# EAGLE schematic 40x24 (EAGLE 6.2), part 1 of 2

## Sheet 1 of 4
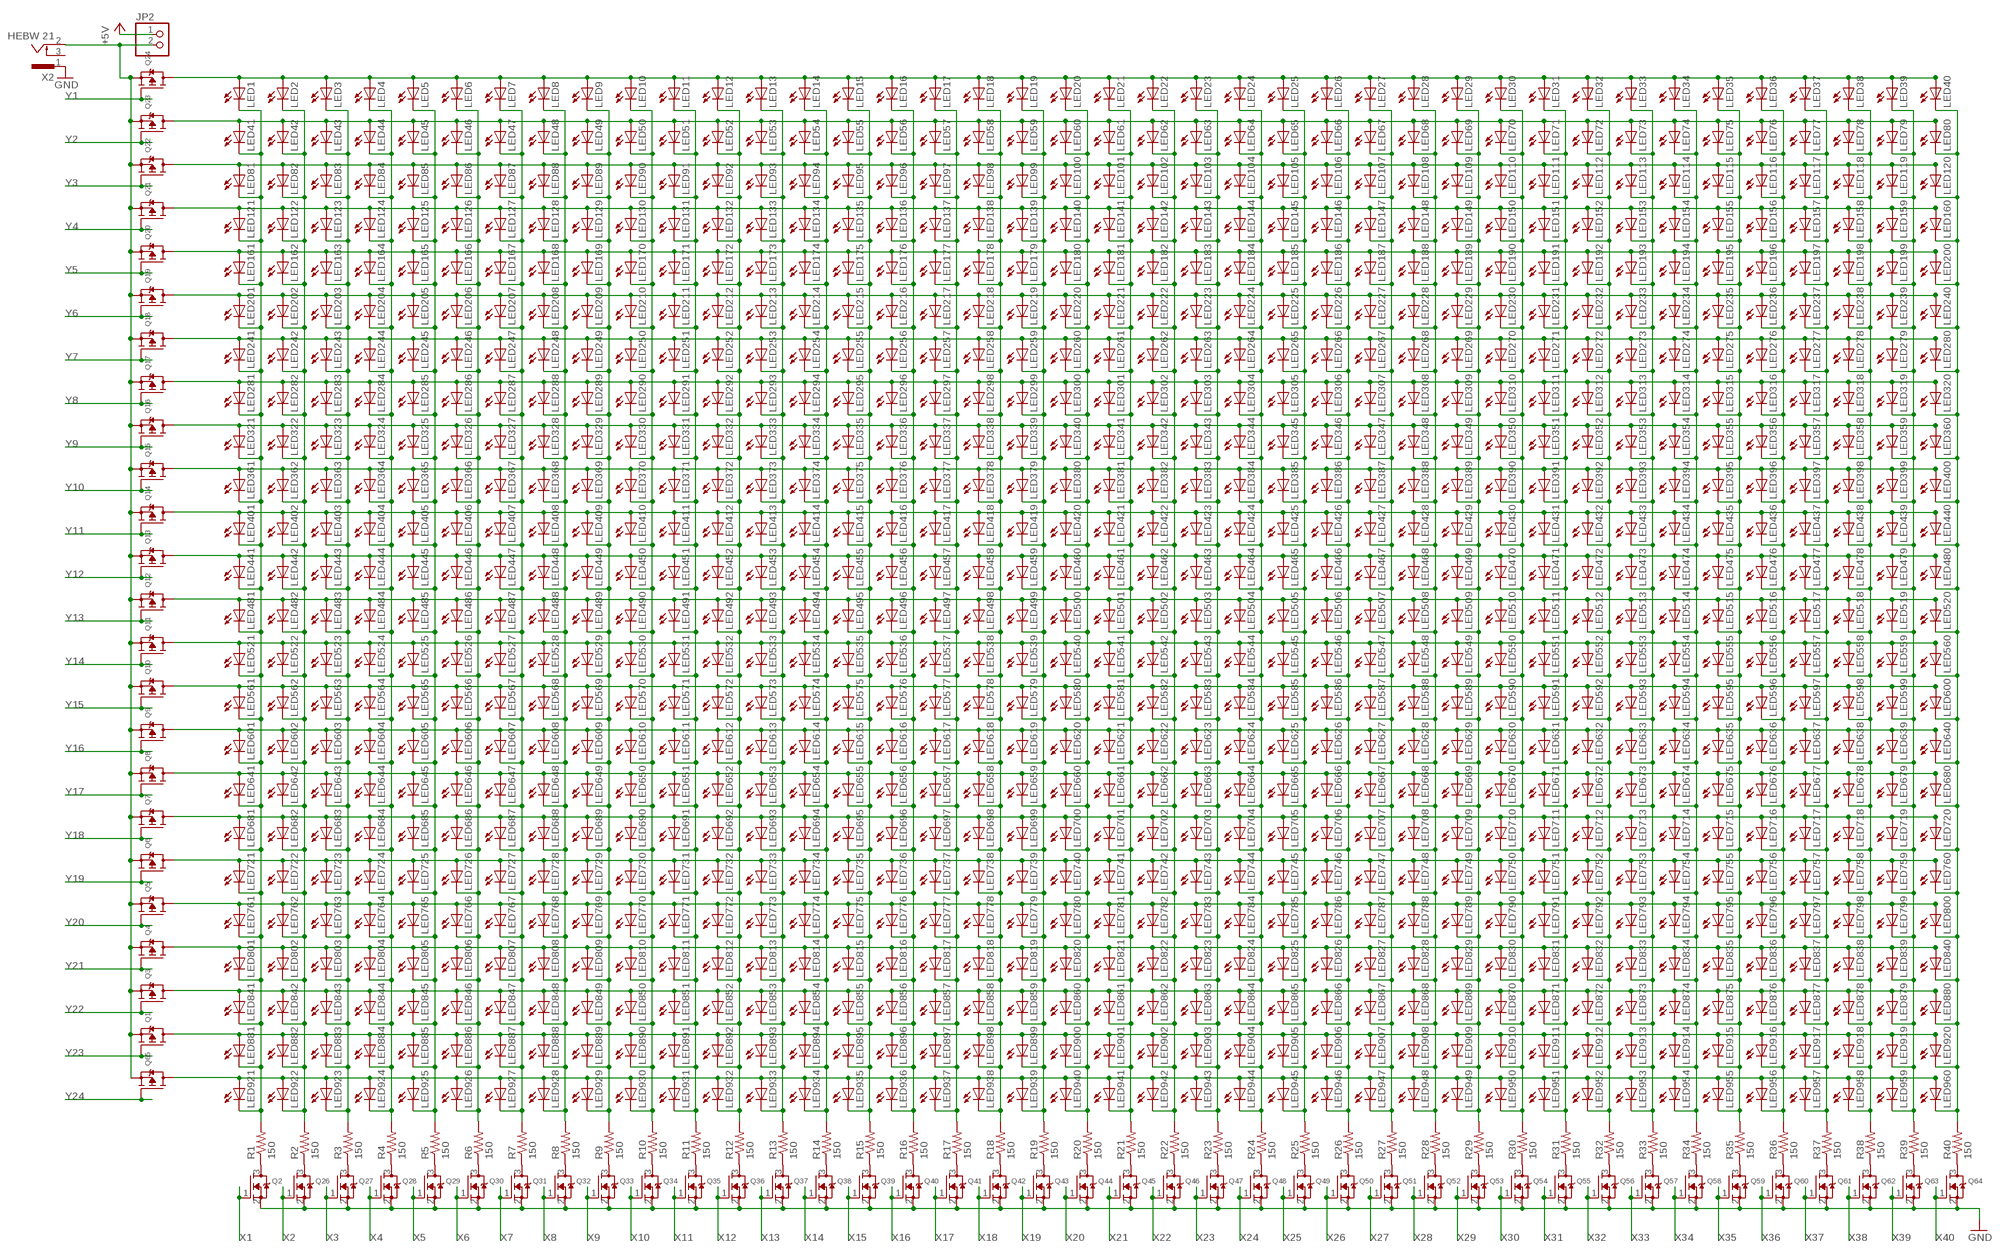
[diagram p0: schematic, sheet 1]

### Parts
JP2  PINHD-1X2  [1X02]
LED1  LED3MM  [LED3MM]
LED2  LED3MM  [LED3MM]
LED3  LED3MM  [LED3MM]
LED4  LED3MM  [LED3MM]
LED5  LED3MM  [LED3MM]
LED6  LED3MM  [LED3MM]
LED7  LED3MM  [LED3MM]
LED8  LED3MM  [LED3MM]
LED9  LED3MM  [LED3MM]
LED10  LED3MM  [LED3MM]
LED11  LED3MM  [LED3MM]
LED12  LED3MM  [LED3MM]
LED13  LED3MM  [LED3MM]
LED14  LED3MM  [LED3MM]
LED15  LED3MM  [LED3MM]
LED16  LED3MM  [LED3MM]
LED17  LED3MM  [LED3MM]
LED18  LED3MM  [LED3MM]
LED19  LED3MM  [LED3MM]
LED20  LED3MM  [LED3MM]
LED21  LED3MM  [LED3MM]
LED22  LED3MM  [LED3MM]
LED23  LED3MM  [LED3MM]
LED24  LED3MM  [LED3MM]
LED25  LED3MM  [LED3MM]
LED26  LED3MM  [LED3MM]
LED27  LED3MM  [LED3MM]
LED28  LED3MM  [LED3MM]
LED29  LED3MM  [LED3MM]
LED30  LED3MM  [LED3MM]
LED31  LED3MM  [LED3MM]
LED32  LED3MM  [LED3MM]
LED33  LED3MM  [LED3MM]
LED34  LED3MM  [LED3MM]
LED35  LED3MM  [LED3MM]
LED36  LED3MM  [LED3MM]
LED37  LED3MM  [LED3MM]
LED38  LED3MM  [LED3MM]
LED39  LED3MM  [LED3MM]
LED40  LED3MM  [LED3MM]
LED41  LED3MM  [LED3MM]
LED42  LED3MM  [LED3MM]
LED43  LED3MM  [LED3MM]
LED44  LED3MM  [LED3MM]
LED45  LED3MM  [LED3MM]
LED46  LED3MM  [LED3MM]
LED47  LED3MM  [LED3MM]
LED48  LED3MM  [LED3MM]
LED49  LED3MM  [LED3MM]
LED50  LED3MM  [LED3MM]
LED51  LED3MM  [LED3MM]
LED52  LED3MM  [LED3MM]
LED53  LED3MM  [LED3MM]
LED54  LED3MM  [LED3MM]
LED55  LED3MM  [LED3MM]
LED56  LED3MM  [LED3MM]
LED57  LED3MM  [LED3MM]
LED58  LED3MM  [LED3MM]
LED59  LED3MM  [LED3MM]
LED60  LED3MM  [LED3MM]
LED61  LED3MM  [LED3MM]
LED62  LED3MM  [LED3MM]
LED63  LED3MM  [LED3MM]
LED64  LED3MM  [LED3MM]
LED65  LED3MM  [LED3MM]
LED66  LED3MM  [LED3MM]
LED67  LED3MM  [LED3MM]
LED68  LED3MM  [LED3MM]
LED69  LED3MM  [LED3MM]
LED70  LED3MM  [LED3MM]
LED71  LED3MM  [LED3MM]
LED72  LED3MM  [LED3MM]
LED73  LED3MM  [LED3MM]
LED74  LED3MM  [LED3MM]
LED75  LED3MM  [LED3MM]
LED76  LED3MM  [LED3MM]
LED77  LED3MM  [LED3MM]
LED78  LED3MM  [LED3MM]
LED79  LED3MM  [LED3MM]
LED80  LED3MM  [LED3MM]
LED81  LED3MM  [LED3MM]
LED82  LED3MM  [LED3MM]
LED83  LED3MM  [LED3MM]
LED84  LED3MM  [LED3MM]
LED85  LED3MM  [LED3MM]
LED86  LED3MM  [LED3MM]
LED87  LED3MM  [LED3MM]
LED88  LED3MM  [LED3MM]
LED89  LED3MM  [LED3MM]
LED90  LED3MM  [LED3MM]
LED91  LED3MM  [LED3MM]
LED92  LED3MM  [LED3MM]
LED93  LED3MM  [LED3MM]
LED94  LED3MM  [LED3MM]
LED95  LED3MM  [LED3MM]
LED96  LED3MM  [LED3MM]
LED97  LED3MM  [LED3MM]
LED98  LED3MM  [LED3MM]
LED99  LED3MM  [LED3MM]
LED100  LED3MM  [LED3MM]
LED101  LED3MM  [LED3MM]
LED102  LED3MM  [LED3MM]
LED103  LED3MM  [LED3MM]
LED104  LED3MM  [LED3MM]
LED105  LED3MM  [LED3MM]
LED106  LED3MM  [LED3MM]
LED107  LED3MM  [LED3MM]
LED108  LED3MM  [LED3MM]
LED109  LED3MM  [LED3MM]
LED110  LED3MM  [LED3MM]
LED111  LED3MM  [LED3MM]
LED112  LED3MM  [LED3MM]
LED113  LED3MM  [LED3MM]
LED114  LED3MM  [LED3MM]
LED115  LED3MM  [LED3MM]
LED116  LED3MM  [LED3MM]
LED117  LED3MM  [LED3MM]
LED118  LED3MM  [LED3MM]
LED119  LED3MM  [LED3MM]
LED120  LED3MM  [LED3MM]
LED121  LED3MM  [LED3MM]
LED122  LED3MM  [LED3MM]
LED123  LED3MM  [LED3MM]
LED124  LED3MM  [LED3MM]
LED125  LED3MM  [LED3MM]
LED126  LED3MM  [LED3MM]
LED127  LED3MM  [LED3MM]
LED128  LED3MM  [LED3MM]
LED129  LED3MM  [LED3MM]
LED130  LED3MM  [LED3MM]
LED131  LED3MM  [LED3MM]
LED132  LED3MM  [LED3MM]
LED133  LED3MM  [LED3MM]
LED134  LED3MM  [LED3MM]
LED135  LED3MM  [LED3MM]
LED136  LED3MM  [LED3MM]
LED137  LED3MM  [LED3MM]
LED138  LED3MM  [LED3MM]
LED139  LED3MM  [LED3MM]
LED140  LED3MM  [LED3MM]
LED141  LED3MM  [LED3MM]
LED142  LED3MM  [LED3MM]
LED143  LED3MM  [LED3MM]
LED144  LED3MM  [LED3MM]
LED145  LED3MM  [LED3MM]
LED146  LED3MM  [LED3MM]
LED147  LED3MM  [LED3MM]
LED148  LED3MM  [LED3MM]
LED149  LED3MM  [LED3MM]
LED150  LED3MM  [LED3MM]
LED151  LED3MM  [LED3MM]
LED152  LED3MM  [LED3MM]
LED153  LED3MM  [LED3MM]
LED154  LED3MM  [LED3MM]
LED155  LED3MM  [LED3MM]
LED156  LED3MM  [LED3MM]
LED157  LED3MM  [LED3MM]
LED158  LED3MM  [LED3MM]
LED159  LED3MM  [LED3MM]
LED160  LED3MM  [LED3MM]
LED161  LED3MM  [LED3MM]
LED162  LED3MM  [LED3MM]
LED163  LED3MM  [LED3MM]
LED164  LED3MM  [LED3MM]
LED165  LED3MM  [LED3MM]
LED166  LED3MM  [LED3MM]
LED167  LED3MM  [LED3MM]
LED168  LED3MM  [LED3MM]
LED169  LED3MM  [LED3MM]
LED170  LED3MM  [LED3MM]
LED171  LED3MM  [LED3MM]
LED172  LED3MM  [LED3MM]
LED173  LED3MM  [LED3MM]
LED174  LED3MM  [LED3MM]
LED175  LED3MM  [LED3MM]
LED176  LED3MM  [LED3MM]
LED177  LED3MM  [LED3MM]
LED178  LED3MM  [LED3MM]
LED179  LED3MM  [LED3MM]
LED180  LED3MM  [LED3MM]
LED181  LED3MM  [LED3MM]
LED182  LED3MM  [LED3MM]
LED183  LED3MM  [LED3MM]
LED184  LED3MM  [LED3MM]
LED185  LED3MM  [LED3MM]
LED186  LED3MM  [LED3MM]
LED187  LED3MM  [LED3MM]
LED188  LED3MM  [LED3MM]
LED189  LED3MM  [LED3MM]
LED190  LED3MM  [LED3MM]
LED191  LED3MM  [LED3MM]
LED192  LED3MM  [LED3MM]
LED193  LED3MM  [LED3MM]
LED194  LED3MM  [LED3MM]
LED195  LED3MM  [LED3MM]
LED196  LED3MM  [LED3MM]
LED197  LED3MM  [LED3MM]
LED198  LED3MM  [LED3MM]
LED199  LED3MM  [LED3MM]
LED200  LED3MM  [LED3MM]
LED201  LED3MM  [LED3MM]
LED202  LED3MM  [LED3MM]
LED203  LED3MM  [LED3MM]
LED204  LED3MM  [LED3MM]
LED205  LED3MM  [LED3MM]
LED206  LED3MM  [LED3MM]
LED207  LED3MM  [LED3MM]
LED208  LED3MM  [LED3MM]
LED209  LED3MM  [LED3MM]
LED210  LED3MM  [LED3MM]
LED211  LED3MM  [LED3MM]
LED212  LED3MM  [LED3MM]
LED213  LED3MM  [LED3MM]
LED214  LED3MM  [LED3MM]
LED215  LED3MM  [LED3MM]
LED216  LED3MM  [LED3MM]
LED217  LED3MM  [LED3MM]
LED218  LED3MM  [LED3MM]
LED219  LED3MM  [LED3MM]
LED220  LED3MM  [LED3MM]
LED221  LED3MM  [LED3MM]
LED222  LED3MM  [LED3MM]
LED223  LED3MM  [LED3MM]
LED224  LED3MM  [LED3MM]
LED225  LED3MM  [LED3MM]
LED226  LED3MM  [LED3MM]
LED227  LED3MM  [LED3MM]
LED228  LED3MM  [LED3MM]
LED229  LED3MM  [LED3MM]
LED230  LED3MM  [LED3MM]
LED231  LED3MM  [LED3MM]
LED232  LED3MM  [LED3MM]
LED233  LED3MM  [LED3MM]
LED234  LED3MM  [LED3MM]
LED235  LED3MM  [LED3MM]
LED236  LED3MM  [LED3MM]
LED237  LED3MM  [LED3MM]
LED238  LED3MM  [LED3MM]
LED239  LED3MM  [LED3MM]
LED240  LED3MM  [LED3MM]
LED241  LED3MM  [LED3MM]
LED242  LED3MM  [LED3MM]
LED243  LED3MM  [LED3MM]
LED244  LED3MM  [LED3MM]
LED245  LED3MM  [LED3MM]
LED246  LED3MM  [LED3MM]
LED247  LED3MM  [LED3MM]
LED248  LED3MM  [LED3MM]
LED249  LED3MM  [LED3MM]
LED250  LED3MM  [LED3MM]
LED251  LED3MM  [LED3MM]
LED252  LED3MM  [LED3MM]
LED253  LED3MM  [LED3MM]
LED254  LED3MM  [LED3MM]
LED255  LED3MM  [LED3MM]
LED256  LED3MM  [LED3MM]
LED257  LED3MM  [LED3MM]
LED258  LED3MM  [LED3MM]
LED259  LED3MM  [LED3MM]
LED260  LED3MM  [LED3MM]
LED261  LED3MM  [LED3MM]
LED262  LED3MM  [LED3MM]
LED263  LED3MM  [LED3MM]
LED264  LED3MM  [LED3MM]
LED265  LED3MM  [LED3MM]
LED266  LED3MM  [LED3MM]
LED267  LED3MM  [LED3MM]
LED268  LED3MM  [LED3MM]
LED269  LED3MM  [LED3MM]
LED270  LED3MM  [LED3MM]
LED271  LED3MM  [LED3MM]
LED272  LED3MM  [LED3MM]
LED273  LED3MM  [LED3MM]
LED274  LED3MM  [LED3MM]
LED275  LED3MM  [LED3MM]
LED276  LED3MM  [LED3MM]
LED277  LED3MM  [LED3MM]
LED278  LED3MM  [LED3MM]
LED279  LED3MM  [LED3MM]
LED280  LED3MM  [LED3MM]
LED281  LED3MM  [LED3MM]
LED282  LED3MM  [LED3MM]
LED283  LED3MM  [LED3MM]
LED284  LED3MM  [LED3MM]
LED285  LED3MM  [LED3MM]
LED286  LED3MM  [LED3MM]
LED287  LED3MM  [LED3MM]
LED288  LED3MM  [LED3MM]
LED289  LED3MM  [LED3MM]
LED290  LED3MM  [LED3MM]
LED291  LED3MM  [LED3MM]
LED292  LED3MM  [LED3MM]
LED293  LED3MM  [LED3MM]
LED294  LED3MM  [LED3MM]
LED295  LED3MM  [LED3MM]
LED296  LED3MM  [LED3MM]
LED297  LED3MM  [LED3MM]
LED298  LED3MM  [LED3MM]
LED299  LED3MM  [LED3MM]
LED300  LED3MM  [LED3MM]
LED301  LED3MM  [LED3MM]
LED302  LED3MM  [LED3MM]
LED303  LED3MM  [LED3MM]
LED304  LED3MM  [LED3MM]
LED305  LED3MM  [LED3MM]
LED306  LED3MM  [LED3MM]
LED307  LED3MM  [LED3MM]
LED308  LED3MM  [LED3MM]
LED309  LED3MM  [LED3MM]
LED310  LED3MM  [LED3MM]
LED311  LED3MM  [LED3MM]
LED312  LED3MM  [LED3MM]
LED313  LED3MM  [LED3MM]
LED314  LED3MM  [LED3MM]
LED315  LED3MM  [LED3MM]
LED316  LED3MM  [LED3MM]
LED317  LED3MM  [LED3MM]
LED318  LED3MM  [LED3MM]
LED319  LED3MM  [LED3MM]
LED320  LED3MM  [LED3MM]
LED321  LED3MM  [LED3MM]
LED322  LED3MM  [LED3MM]
LED323  LED3MM  [LED3MM]
LED324  LED3MM  [LED3MM]
LED325  LED3MM  [LED3MM]
LED326  LED3MM  [LED3MM]
LED327  LED3MM  [LED3MM]
LED328  LED3MM  [LED3MM]
LED329  LED3MM  [LED3MM]
LED330  LED3MM  [LED3MM]
LED331  LED3MM  [LED3MM]
LED332  LED3MM  [LED3MM]
LED333  LED3MM  [LED3MM]
LED334  LED3MM  [LED3MM]
LED335  LED3MM  [LED3MM]
LED336  LED3MM  [LED3MM]
LED337  LED3MM  [LED3MM]
LED338  LED3MM  [LED3MM]
LED339  LED3MM  [LED3MM]
LED340  LED3MM  [LED3MM]
LED341  LED3MM  [LED3MM]
LED342  LED3MM  [LED3MM]
LED343  LED3MM  [LED3MM]
LED344  LED3MM  [LED3MM]
LED345  LED3MM  [LED3MM]
LED346  LED3MM  [LED3MM]
LED347  LED3MM  [LED3MM]
LED348  LED3MM  [LED3MM]
LED349  LED3MM  [LED3MM]
LED350  LED3MM  [LED3MM]
LED351  LED3MM  [LED3MM]
LED352  LED3MM  [LED3MM]
LED353  LED3MM  [LED3MM]
LED354  LED3MM  [LED3MM]
LED355  LED3MM  [LED3MM]
LED356  LED3MM  [LED3MM]
LED357  LED3MM  [LED3MM]
LED358  LED3MM  [LED3MM]
LED359  LED3MM  [LED3MM]
LED360  LED3MM  [LED3MM]
LED361  LED3MM  [LED3MM]
LED362  LED3MM  [LED3MM]
LED363  LED3MM  [LED3MM]
LED364  LED3MM  [LED3MM]
LED365  LED3MM  [LED3MM]
LED366  LED3MM  [LED3MM]
LED367  LED3MM  [LED3MM]
LED368  LED3MM  [LED3MM]
LED369  LED3MM  [LED3MM]
LED370  LED3MM  [LED3MM]
LED371  LED3MM  [LED3MM]
LED372  LED3MM  [LED3MM]
LED373  LED3MM  [LED3MM]
LED374  LED3MM  [LED3MM]
LED375  LED3MM  [LED3MM]
LED376  LED3MM  [LED3MM]
LED377  LED3MM  [LED3MM]
LED378  LED3MM  [LED3MM]
LED379  LED3MM  [LED3MM]
LED380  LED3MM  [LED3MM]
LED381  LED3MM  [LED3MM]
LED382  LED3MM  [LED3MM]
LED383  LED3MM  [LED3MM]
LED384  LED3MM  [LED3MM]
LED385  LED3MM  [LED3MM]
LED386  LED3MM  [LED3MM]
LED387  LED3MM  [LED3MM]
LED388  LED3MM  [LED3MM]
LED389  LED3MM  [LED3MM]
LED390  LED3MM  [LED3MM]
LED391  LED3MM  [LED3MM]
LED392  LED3MM  [LED3MM]
LED393  LED3MM  [LED3MM]
LED394  LED3MM  [LED3MM]
LED395  LED3MM  [LED3MM]
LED396  LED3MM  [LED3MM]
LED397  LED3MM  [LED3MM]
LED398  LED3MM  [LED3MM]
LED399  LED3MM  [LED3MM]
LED400  LED3MM  [LED3MM]
LED401  LED3MM  [LED3MM]
LED402  LED3MM  [LED3MM]
LED403  LED3MM  [LED3MM]
LED404  LED3MM  [LED3MM]
LED405  LED3MM  [LED3MM]
LED406  LED3MM  [LED3MM]
LED407  LED3MM  [LED3MM]
LED408  LED3MM  [LED3MM]
LED409  LED3MM  [LED3MM]
LED410  LED3MM  [LED3MM]
LED411  LED3MM  [LED3MM]
LED412  LED3MM  [LED3MM]
LED413  LED3MM  [LED3MM]
LED414  LED3MM  [LED3MM]
LED415  LED3MM  [LED3MM]
LED416  LED3MM  [LED3MM]
LED417  LED3MM  [LED3MM]
LED418  LED3MM  [LED3MM]
LED419  LED3MM  [LED3MM]
LED420  LED3MM  [LED3MM]
LED421  LED3MM  [LED3MM]
LED422  LED3MM  [LED3MM]
LED423  LED3MM  [LED3MM]
LED424  LED3MM  [LED3MM]
LED425  LED3MM  [LED3MM]
LED426  LED3MM  [LED3MM]
LED427  LED3MM  [LED3MM]
LED428  LED3MM  [LED3MM]
LED429  LED3MM  [LED3MM]
LED430  LED3MM  [LED3MM]
LED431  LED3MM  [LED3MM]
LED432  LED3MM  [LED3MM]
LED433  LED3MM  [LED3MM]
LED434  LED3MM  [LED3MM]
LED435  LED3MM  [LED3MM]
LED436  LED3MM  [LED3MM]
LED437  LED3MM  [LED3MM]
LED438  LED3MM  [LED3MM]
LED439  LED3MM  [LED3MM]
LED440  LED3MM  [LED3MM]
LED441  LED3MM  [LED3MM]
LED442  LED3MM  [LED3MM]
LED443  LED3MM  [LED3MM]
LED444  LED3MM  [LED3MM]
LED445  LED3MM  [LED3MM]
LED446  LED3MM  [LED3MM]
LED447  LED3MM  [LED3MM]
LED448  LED3MM  [LED3MM]
LED449  LED3MM  [LED3MM]
LED450  LED3MM  [LED3MM]
LED451  LED3MM  [LED3MM]
LED452  LED3MM  [LED3MM]
LED453  LED3MM  [LED3MM]
LED454  LED3MM  [LED3MM]
LED455  LED3MM  [LED3MM]
LED456  LED3MM  [LED3MM]
LED457  LED3MM  [LED3MM]
LED458  LED3MM  [LED3MM]
LED459  LED3MM  [LED3MM]
LED460  LED3MM  [LED3MM]
LED461  LED3MM  [LED3MM]
LED462  LED3MM  [LED3MM]
LED463  LED3MM  [LED3MM]
LED464  LED3MM  [LED3MM]
LED465  LED3MM  [LED3MM]
LED466  LED3MM  [LED3MM]
LED467  LED3MM  [LED3MM]
LED468  LED3MM  [LED3MM]
LED469  LED3MM  [LED3MM]
LED470  LED3MM  [LED3MM]
LED471  LED3MM  [LED3MM]
LED472  LED3MM  [LED3MM]
LED473  LED3MM  [LED3MM]
LED474  LED3MM  [LED3MM]
LED475  LED3MM  [LED3MM]
LED476  LED3MM  [LED3MM]
LED477  LED3MM  [LED3MM]
LED478  LED3MM  [LED3MM]
LED479  LED3MM  [LED3MM]
LED480  LED3MM  [LED3MM]
LED481  LED3MM  [LED3MM]
LED482  LED3MM  [LED3MM]
LED483  LED3MM  [LED3MM]
LED484  LED3MM  [LED3MM]
LED485  LED3MM  [LED3MM]
LED486  LED3MM  [LED3MM]
LED487  LED3MM  [LED3MM]
LED488  LED3MM  [LED3MM]
LED489  LED3MM  [LED3MM]
LED490  LED3MM  [LED3MM]
LED491  LED3MM  [LED3MM]
LED492  LED3MM  [LED3MM]
LED493  LED3MM  [LED3MM]
LED494  LED3MM  [LED3MM]
LED495  LED3MM  [LED3MM]
LED496  LED3MM  [LED3MM]
LED497  LED3MM  [LED3MM]
LED498  LED3MM  [LED3MM]
LED499  LED3MM  [LED3MM]
LED500  LED3MM  [LED3MM]
LED501  LED3MM  [LED3MM]
LED502  LED3MM  [LED3MM]
LED503  LED3MM  [LED3MM]
LED504  LED3MM  [LED3MM]
LED505  LED3MM  [LED3MM]
LED506  LED3MM  [LED3MM]
LED507  LED3MM  [LED3MM]
LED508  LED3MM  [LED3MM]
LED509  LED3MM  [LED3MM]
LED510  LED3MM  [LED3MM]
LED511  LED3MM  [LED3MM]
LED512  LED3MM  [LED3MM]
LED513  LED3MM  [LED3MM]
LED514  LED3MM  [LED3MM]
LED515  LED3MM  [LED3MM]
LED516  LED3MM  [LED3MM]
LED517  LED3MM  [LED3MM]
LED518  LED3MM  [LED3MM]
LED519  LED3MM  [LED3MM]
LED520  LED3MM  [LED3MM]
LED521  LED3MM  [LED3MM]
LED522  LED3MM  [LED3MM]
LED523  LED3MM  [LED3MM]
LED524  LED3MM  [LED3MM]
LED525  LED3MM  [LED3MM]
LED526  LED3MM  [LED3MM]
LED527  LED3MM  [LED3MM]
LED528  LED3MM  [LED3MM]
LED529  LED3MM  [LED3MM]
LED530  LED3MM  [LED3MM]
LED531  LED3MM  [LED3MM]
LED532  LED3MM  [LED3MM]
LED533  LED3MM  [LED3MM]
LED534  LED3MM  [LED3MM]
LED535  LED3MM  [LED3MM]
LED536  LED3MM  [LED3MM]
LED537  LED3MM  [LED3MM]
LED538  LED3MM  [LED3MM]
LED539  LED3MM  [LED3MM]
LED540  LED3MM  [LED3MM]
LED541  LED3MM  [LED3MM]
LED542  LED3MM  [LED3MM]
LED543  LED3MM  [LED3MM]
LED544  LED3MM  [LED3MM]
LED545  LED3MM  [LED3MM]
LED546  LED3MM  [LED3MM]
LED547  LED3MM  [LED3MM]
LED548  LED3MM  [LED3MM]
LED549  LED3MM  [LED3MM]
LED550  LED3MM  [LED3MM]
LED551  LED3MM  [LED3MM]
LED552  LED3MM  [LED3MM]
LED553  LED3MM  [LED3MM]
LED554  LED3MM  [LED3MM]
LED555  LED3MM  [LED3MM]
LED556  LED3MM  [LED3MM]
LED557  LED3MM  [LED3MM]
LED558  LED3MM  [LED3MM]
LED559  LED3MM  [LED3MM]
LED560  LED3MM  [LED3MM]
LED561  LED3MM  [LED3MM]
LED562  LED3MM  [LED3MM]
LED563  LED3MM  [LED3MM]
LED564  LED3MM  [LED3MM]
LED565  LED3MM  [LED3MM]
LED566  LED3MM  [LED3MM]
LED567  LED3MM  [LED3MM]
LED568  LED3MM  [LED3MM]
LED569  LED3MM  [LED3MM]
LED570  LED3MM  [LED3MM]
LED571  LED3MM  [LED3MM]
LED572  LED3MM  [LED3MM]
LED573  LED3MM  [LED3MM]
LED574  LED3MM  [LED3MM]
LED575  LED3MM  [LED3MM]
LED576  LED3MM  [LED3MM]
LED577  LED3MM  [LED3MM]
LED578  LED3MM  [LED3MM]
LED579  LED3MM  [LED3MM]
LED580  LED3MM  [LED3MM]
LED581  LED3MM  [LED3MM]
LED582  LED3MM  [LED3MM]
LED583  LED3MM  [LED3MM]
LED584  LED3MM  [LED3MM]
LED585  LED3MM  [LED3MM]
LED586  LED3MM  [LED3MM]
LED587  LED3MM  [LED3MM]
LED588  LED3MM  [LED3MM]
LED589  LED3MM  [LED3MM]
LED590  LED3MM  [LED3MM]
LED591  LED3MM  [LED3MM]
LED592  LED3MM  [LED3MM]
LED593  LED3MM  [LED3MM]
LED594  LED3MM  [LED3MM]
LED595  LED3MM  [LED3MM]
LED596  LED3MM  [LED3MM]
LED597  LED3MM  [LED3MM]
LED598  LED3MM  [LED3MM]
LED599  LED3MM  [LED3MM]
LED600  LED3MM  [LED3MM]
LED601  LED3MM  [LED3MM]
LED602  LED3MM  [LED3MM]
LED603  LED3MM  [LED3MM]
LED604  LED3MM  [LED3MM]
LED605  LED3MM  [LED3MM]
LED606  LED3MM  [LED3MM]
LED607  LED3MM  [LED3MM]
LED608  LED3MM  [LED3MM]
LED609  LED3MM  [LED3MM]
LED610  LED3MM  [LED3MM]
LED611  LED3MM  [LED3MM]
LED612  LED3MM  [LED3MM]
LED613  LED3MM  [LED3MM]
LED614  LED3MM  [LED3MM]
LED615  LED3MM  [LED3MM]
LED616  LED3MM  [LED3MM]
LED617  LED3MM  [LED3MM]
LED618  LED3MM  [LED3MM]
LED619  LED3MM  [LED3MM]
LED620  LED3MM  [LED3MM]
LED621  LED3MM  [LED3MM]
LED622  LED3MM  [LED3MM]
LED623  LED3MM  [LED3MM]
LED624  LED3MM  [LED3MM]
LED625  LED3MM  [LED3MM]
LED626  LED3MM  [LED3MM]
LED627  LED3MM  [LED3MM]
LED628  LED3MM  [LED3MM]
LED629  LED3MM  [LED3MM]
LED630  LED3MM  [LED3MM]
LED631  LED3MM  [LED3MM]
LED632  LED3MM  [LED3MM]
LED633  LED3MM  [LED3MM]
LED634  LED3MM  [LED3MM]
LED635  LED3MM  [LED3MM]
LED636  LED3MM  [LED3MM]
LED637  LED3MM  [LED3MM]
LED638  LED3MM  [LED3MM]
LED639  LED3MM  [LED3MM]
LED640  LED3MM  [LED3MM]
LED641  LED3MM  [LED3MM]
LED642  LED3MM  [LED3MM]
LED643  LED3MM  [LED3MM]
LED644  LED3MM  [LED3MM]
LED645  LED3MM  [LED3MM]
LED646  LED3MM  [LED3MM]
LED647  LED3MM  [LED3MM]
LED648  LED3MM  [LED3MM]
LED649  LED3MM  [LED3MM]
LED650  LED3MM  [LED3MM]
LED651  LED3MM  [LED3MM]
LED652  LED3MM  [LED3MM]
LED653  LED3MM  [LED3MM]
LED654  LED3MM  [LED3MM]
LED655  LED3MM  [LED3MM]
LED656  LED3MM  [LED3MM]
LED657  LED3MM  [LED3MM]
LED658  LED3MM  [LED3MM]
LED659  LED3MM  [LED3MM]
LED660  LED3MM  [LED3MM]
LED661  LED3MM  [LED3MM]
LED662  LED3MM  [LED3MM]
LED663  LED3MM  [LED3MM]
LED664  LED3MM  [LED3MM]
LED665  LED3MM  [LED3MM]
LED666  LED3MM  [LED3MM]
LED667  LED3MM  [LED3MM]
LED668  LED3MM  [LED3MM]
LED669  LED3MM  [LED3MM]
LED670  LED3MM  [LED3MM]
LED671  LED3MM  [LED3MM]
LED672  LED3MM  [LED3MM]
LED673  LED3MM  [LED3MM]
LED674  LED3MM  [LED3MM]
LED675  LED3MM  [LED3MM]
LED676  LED3MM  [LED3MM]
LED677  LED3MM  [LED3MM]
LED678  LED3MM  [LED3MM]
LED679  LED3MM  [LED3MM]
LED680  LED3MM  [LED3MM]
LED681  LED3MM  [LED3MM]
LED682  LED3MM  [LED3MM]
LED683  LED3MM  [LED3MM]
LED684  LED3MM  [LED3MM]
LED685  LED3MM  [LED3MM]
LED686  LED3MM  [LED3MM]
LED687  LED3MM  [LED3MM]
LED688  LED3MM  [LED3MM]
LED689  LED3MM  [LED3MM]
LED690  LED3MM  [LED3MM]
LED691  LED3MM  [LED3MM]
LED692  LED3MM  [LED3MM]
LED693  LED3MM  [LED3MM]
LED694  LED3MM  [LED3MM]
LED695  LED3MM  [LED3MM]
LED696  LED3MM  [LED3MM]
LED697  LED3MM  [LED3MM]
LED698  LED3MM  [LED3MM]
LED699  LED3MM  [LED3MM]
LED700  LED3MM  [LED3MM]
LED701  LED3MM  [LED3MM]
LED702  LED3MM  [LED3MM]
LED703  LED3MM  [LED3MM]
LED704  LED3MM  [LED3MM]
LED705  LED3MM  [LED3MM]
LED706  LED3MM  [LED3MM]
LED707  LED3MM  [LED3MM]
LED708  LED3MM  [LED3MM]
LED709  LED3MM  [LED3MM]
LED710  LED3MM  [LED3MM]
LED711  LED3MM  [LED3MM]
LED712  LED3MM  [LED3MM]
LED713  LED3MM  [LED3MM]
LED714  LED3MM  [LED3MM]
LED715  LED3MM  [LED3MM]
LED716  LED3MM  [LED3MM]
LED717  LED3MM  [LED3MM]
LED718  LED3MM  [LED3MM]
LED719  LED3MM  [LED3MM]
LED720  LED3MM  [LED3MM]
LED721  LED3MM  [LED3MM]
LED722  LED3MM  [LED3MM]
LED723  LED3MM  [LED3MM]
LED724  LED3MM  [LED3MM]
LED725  LED3MM  [LED3MM]
LED726  LED3MM  [LED3MM]
LED727  LED3MM  [LED3MM]
LED728  LED3MM  [LED3MM]
LED729  LED3MM  [LED3MM]
LED730  LED3MM  [LED3MM]
LED731  LED3MM  [LED3MM]
LED732  LED3MM  [LED3MM]
LED733  LED3MM  [LED3MM]
LED734  LED3MM  [LED3MM]
LED735  LED3MM  [LED3MM]
LED736  LED3MM  [LED3MM]
LED737  LED3MM  [LED3MM]
LED738  LED3MM  [LED3MM]
LED739  LED3MM  [LED3MM]
LED740  LED3MM  [LED3MM]
LED741  LED3MM  [LED3MM]
LED742  LED3MM  [LED3MM]
LED743  LED3MM  [LED3MM]
LED744  LED3MM  [LED3MM]
LED745  LED3MM  [LED3MM]
LED746  LED3MM  [LED3MM]
LED747  LED3MM  [LED3MM]
LED748  LED3MM  [LED3MM]
LED749  LED3MM  [LED3MM]
LED750  LED3MM  [LED3MM]
LED751  LED3MM  [LED3MM]
LED752  LED3MM  [LED3MM]
LED753  LED3MM  [LED3MM]
LED754  LED3MM  [LED3MM]
LED755  LED3MM  [LED3MM]
LED756  LED3MM  [LED3MM]
LED757  LED3MM  [LED3MM]
LED758  LED3MM  [LED3MM]
LED759  LED3MM  [LED3MM]
LED760  LED3MM  [LED3MM]
LED761  LED3MM  [LED3MM]
LED762  LED3MM  [LED3MM]
LED763  LED3MM  [LED3MM]
LED764  LED3MM  [LED3MM]
LED765  LED3MM  [LED3MM]
LED766  LED3MM  [LED3MM]
LED767  LED3MM  [LED3MM]
LED768  LED3MM  [LED3MM]
LED769  LED3MM  [LED3MM]
LED770  LED3MM  [LED3MM]
LED771  LED3MM  [LED3MM]
LED772  LED3MM  [LED3MM]
LED773  LED3MM  [LED3MM]
LED774  LED3MM  [LED3MM]
LED775  LED3MM  [LED3MM]
LED776  LED3MM  [LED3MM]
LED777  LED3MM  [LED3MM]
LED778  LED3MM  [LED3MM]
LED779  LED3MM  [LED3MM]
LED780  LED3MM  [LED3MM]
LED781  LED3MM  [LED3MM]
LED782  LED3MM  [LED3MM]
LED783  LED3MM  [LED3MM]
LED784  LED3MM  [LED3MM]
LED785  LED3MM  [LED3MM]
LED786  LED3MM  [LED3MM]
LED787  LED3MM  [LED3MM]
LED788  LED3MM  [LED3MM]
LED789  LED3MM  [LED3MM]
LED790  LED3MM  [LED3MM]
LED791  LED3MM  [LED3MM]
LED792  LED3MM  [LED3MM]
LED793  LED3MM  [LED3MM]
LED794  LED3MM  [LED3MM]
LED795  LED3MM  [LED3MM]
LED796  LED3MM  [LED3MM]
LED797  LED3MM  [LED3MM]
LED798  LED3MM  [LED3MM]
LED799  LED3MM  [LED3MM]
LED800  LED3MM  [LED3MM]
LED801  LED3MM  [LED3MM]
LED802  LED3MM  [LED3MM]
LED803  LED3MM  [LED3MM]
LED804  LED3MM  [LED3MM]
LED805  LED3MM  [LED3MM]
LED806  LED3MM  [LED3MM]
LED807  LED3MM  [LED3MM]
LED808  LED3MM  [LED3MM]
LED809  LED3MM  [LED3MM]
LED810  LED3MM  [LED3MM]
LED811  LED3MM  [LED3MM]
LED812  LED3MM  [LED3MM]
LED813  LED3MM  [LED3MM]
LED814  LED3MM  [LED3MM]
LED815  LED3MM  [LED3MM]
LED816  LED3MM  [LED3MM]
LED817  LED3MM  [LED3MM]
LED818  LED3MM  [LED3MM]
LED819  LED3MM  [LED3MM]
LED820  LED3MM  [LED3MM]
LED821  LED3MM  [LED3MM]
LED822  LED3MM  [LED3MM]
LED823  LED3MM  [LED3MM]
LED824  LED3MM  [LED3MM]
LED825  LED3MM  [LED3MM]
LED826  LED3MM  [LED3MM]
LED827  LED3MM  [LED3MM]
LED828  LED3MM  [LED3MM]
LED829  LED3MM  [LED3MM]
LED830  LED3MM  [LED3MM]
LED831  LED3MM  [LED3MM]
LED832  LED3MM  [LED3MM]
LED833  LED3MM  [LED3MM]
LED834  LED3MM  [LED3MM]
LED835  LED3MM  [LED3MM]
LED836  LED3MM  [LED3MM]
LED837  LED3MM  [LED3MM]
LED838  LED3MM  [LED3MM]
LED839  LED3MM  [LED3MM]
LED840  LED3MM  [LED3MM]
LED841  LED3MM  [LED3MM]
LED842  LED3MM  [LED3MM]
LED843  LED3MM  [LED3MM]
LED844  LED3MM  [LED3MM]
LED845  LED3MM  [LED3MM]
LED846  LED3MM  [LED3MM]
LED847  LED3MM  [LED3MM]
LED848  LED3MM  [LED3MM]
LED849  LED3MM  [LED3MM]
LED850  LED3MM  [LED3MM]
LED851  LED3MM  [LED3MM]
LED852  LED3MM  [LED3MM]
LED853  LED3MM  [LED3MM]
LED854  LED3MM  [LED3MM]
LED855  LED3MM  [LED3MM]
LED856  LED3MM  [LED3MM]
LED857  LED3MM  [LED3MM]
LED858  LED3MM  [LED3MM]
LED859  LED3MM  [LED3MM]
LED860  LED3MM  [LED3MM]
LED861  LED3MM  [LED3MM]
LED862  LED3MM  [LED3MM]
LED863  LED3MM  [LED3MM]
LED864  LED3MM  [LED3MM]
LED865  LED3MM  [LED3MM]
LED866  LED3MM  [LED3MM]
LED867  LED3MM  [LED3MM]
LED868  LED3MM  [LED3MM]
LED869  LED3MM  [LED3MM]
LED870  LED3MM  [LED3MM]
LED871  LED3MM  [LED3MM]
LED872  LED3MM  [LED3MM]
LED873  LED3MM  [LED3MM]
LED874  LED3MM  [LED3MM]
LED875  LED3MM  [LED3MM]
LED876  LED3MM  [LED3MM]
LED877  LED3MM  [LED3MM]
LED878  LED3MM  [LED3MM]
LED879  LED3MM  [LED3MM]
LED880  LED3MM  [LED3MM]
LED881  LED3MM  [LED3MM]
LED882  LED3MM  [LED3MM]
LED883  LED3MM  [LED3MM]
LED884  LED3MM  [LED3MM]
LED885  LED3MM  [LED3MM]
LED886  LED3MM  [LED3MM]
LED887  LED3MM  [LED3MM]
LED888  LED3MM  [LED3MM]
LED889  LED3MM  [LED3MM]
LED890  LED3MM  [LED3MM]
LED891  LED3MM  [LED3MM]
LED892  LED3MM  [LED3MM]
LED893  LED3MM  [LED3MM]
LED894  LED3MM  [LED3MM]
LED895  LED3MM  [LED3MM]
LED896  LED3MM  [LED3MM]
LED897  LED3MM  [LED3MM]
LED898  LED3MM  [LED3MM]
LED899  LED3MM  [LED3MM]
LED900  LED3MM  [LED3MM]
LED901  LED3MM  [LED3MM]
LED902  LED3MM  [LED3MM]
LED903  LED3MM  [LED3MM]
LED904  LED3MM  [LED3MM]
LED905  LED3MM  [LED3MM]
LED906  LED3MM  [LED3MM]
LED907  LED3MM  [LED3MM]
LED908  LED3MM  [LED3MM]
LED909  LED3MM  [LED3MM]
LED910  LED3MM  [LED3MM]
LED911  LED3MM  [LED3MM]
LED912  LED3MM  [LED3MM]
LED913  LED3MM  [LED3MM]
LED914  LED3MM  [LED3MM]
LED915  LED3MM  [LED3MM]
LED916  LED3MM  [LED3MM]
LED917  LED3MM  [LED3MM]
LED918  LED3MM  [LED3MM]
LED919  LED3MM  [LED3MM]
LED920  LED3MM  [LED3MM]
LED921  LED3MM  [LED3MM]
LED922  LED3MM  [LED3MM]
LED923  LED3MM  [LED3MM]
LED924  LED3MM  [LED3MM]
LED925  LED3MM  [LED3MM]
LED926  LED3MM  [LED3MM]
LED927  LED3MM  [LED3MM]
LED928  LED3MM  [LED3MM]
LED929  LED3MM  [LED3MM]
LED930  LED3MM  [LED3MM]
LED931  LED3MM  [LED3MM]
LED932  LED3MM  [LED3MM]
LED933  LED3MM  [LED3MM]
LED934  LED3MM  [LED3MM]
LED935  LED3MM  [LED3MM]
LED936  LED3MM  [LED3MM]
LED937  LED3MM  [LED3MM]
LED938  LED3MM  [LED3MM]
LED939  LED3MM  [LED3MM]
LED940  LED3MM  [LED3MM]
LED941  LED3MM  [LED3MM]
LED942  LED3MM  [LED3MM]
LED943  LED3MM  [LED3MM]
LED944  LED3MM  [LED3MM]
LED945  LED3MM  [LED3MM]
LED946  LED3MM  [LED3MM]
LED947  LED3MM  [LED3MM]
LED948  LED3MM  [LED3MM]
LED949  LED3MM  [LED3MM]
LED950  LED3MM  [LED3MM]
LED951  LED3MM  [LED3MM]
LED952  LED3MM  [LED3MM]
LED953  LED3MM  [LED3MM]
LED954  LED3MM  [LED3MM]
LED955  LED3MM  [LED3MM]
LED956  LED3MM  [LED3MM]
LED957  LED3MM  [LED3MM]
LED958  LED3MM  [LED3MM]
LED959  LED3MM  [LED3MM]
LED960  LED3MM  [LED3MM]
Q1  MOSFET-P  [SOT23-R]
Q2  MOSFET-NREFLOW  [SOT23-R]
Q3  MOSFET-P  [SOT23-R]
Q4  MOSFET-P  [SOT23-R]
Q5  MOSFET-P  [SOT23-R]
Q6  MOSFET-P  [SOT23-R]
Q7  MOSFET-P  [SOT23-R]
Q8  MOSFET-P  [SOT23-R]
Q9  MOSFET-P  [SOT23-R]
Q10  MOSFET-P  [SOT23-R]
Q11  MOSFET-P  [SOT23-R]
Q12  MOSFET-P  [SOT23-R]
Q13  MOSFET-P  [SOT23-R]
Q14  MOSFET-P  [SOT23-R]
Q15  MOSFET-P  [SOT23-R]
Q16  MOSFET-P  [SOT23-R]
Q17  MOSFET-P  [SOT23-R]
Q18  MOSFET-P  [SOT23-R]
Q19  MOSFET-P  [SOT23-R]
Q20  MOSFET-P  [SOT23-R]
Q21  MOSFET-P  [SOT23-R]
Q22  MOSFET-P  [SOT23-R]
Q23  MOSFET-P  [SOT23-R]
Q24  MOSFET-P  [SOT23-R]
Q26  MOSFET-NREFLOW  [SOT23-R]
Q27  MOSFET-NREFLOW  [SOT23-R]
Q28  MOSFET-NREFLOW  [SOT23-R]
Q29  MOSFET-NREFLOW  [SOT23-R]
Q30  MOSFET-NREFLOW  [SOT23-R]
Q31  MOSFET-NREFLOW  [SOT23-R]
Q32  MOSFET-NREFLOW  [SOT23-R]
Q33  MOSFET-NREFLOW  [SOT23-R]
Q34  MOSFET-NREFLOW  [SOT23-R]
Q35  MOSFET-NREFLOW  [SOT23-R]
Q36  MOSFET-NREFLOW  [SOT23-R]
Q37  MOSFET-NREFLOW  [SOT23-R]
Q38  MOSFET-NREFLOW  [SOT23-R]
Q39  MOSFET-NREFLOW  [SOT23-R]
Q40  MOSFET-NREFLOW  [SOT23-R]
Q41  MOSFET-NREFLOW  [SOT23-R]
Q42  MOSFET-NREFLOW  [SOT23-R]
Q43  MOSFET-NREFLOW  [SOT23-R]
Q44  MOSFET-NREFLOW  [SOT23-R]
Q45  MOSFET-NREFLOW  [SOT23-R]
Q46  MOSFET-NREFLOW  [SOT23-R]
Q47  MOSFET-NREFLOW  [SOT23-R]
Q48  MOSFET-NREFLOW  [SOT23-R]
Q49  MOSFET-NREFLOW  [SOT23-R]
Q50  MOSFET-NREFLOW  [SOT23-R]
Q51  MOSFET-NREFLOW  [SOT23-R]
Q52  MOSFET-NREFLOW  [SOT23-R]
Q53  MOSFET-NREFLOW  [SOT23-R]
Q54  MOSFET-NREFLOW  [SOT23-R]
Q55  MOSFET-NREFLOW  [SOT23-R]
Q56  MOSFET-NREFLOW  [SOT23-R]
Q57  MOSFET-NREFLOW  [SOT23-R]
Q58  MOSFET-NREFLOW  [SOT23-R]
Q59  MOSFET-NREFLOW  [SOT23-R]
Q60  MOSFET-NREFLOW  [SOT23-R]
Q61  MOSFET-NREFLOW  [SOT23-R]
Q62  MOSFET-NREFLOW  [SOT23-R]
Q63  MOSFET-NREFLOW  [SOT23-R]
Q64  MOSFET-NREFLOW  [SOT23-R]
Q65  MOSFET-P  [SOT23-R]
R1  150  RESISTOR0805-RES  [0805]
R2  150  RESISTOR0805-RES  [0805]
R3  150  RESISTOR0805-RES  [0805]
R4  150  RESISTOR0805-RES  [0805]
R5  150  RESISTOR0805-RES  [0805]
R6  150  RESISTOR0805-RES  [0805]
R7  150  RESISTOR0805-RES  [0805]
R8  150  RESISTOR0805-RES  [0805]
R9  150  RESISTOR0805-RES  [0805]
R10  150  RESISTOR0805-RES  [0805]
R11  150  RESISTOR0805-RES  [0805]
R12  150  RESISTOR0805-RES  [0805]
R13  150  RESISTOR0805-RES  [0805]
R14  150  RESISTOR0805-RES  [0805]
R15  150  RESISTOR0805-RES  [0805]
R16  150  RESISTOR0805-RES  [0805]
R17  150  RESISTOR0805-RES  [0805]
R18  150  RESISTOR0805-RES  [0805]
R19  150  RESISTOR0805-RES  [0805]
R20  150  RESISTOR0805-RES  [0805]
R21  150  RESISTOR0805-RES  [0805]
R22  150  RESISTOR0805-RES  [0805]
R23  150  RESISTOR0805-RES  [0805]
R24  150  RESISTOR0805-RES  [0805]
R25  150  RESISTOR0805-RES  [0805]
R26  150  RESISTOR0805-RES  [0805]
R27  150  RESISTOR0805-RES  [0805]
R28  150  RESISTOR0805-RES  [0805]
R29  150  RESISTOR0805-RES  [0805]
R30  150  RESISTOR0805-RES  [0805]
R31  150  RESISTOR0805-RES  [0805]
R32  150  RESISTOR0805-RES  [0805]
R33  150  RESISTOR0805-RES  [0805]
R34  150  RESISTOR0805-RES  [0805]
R35  150  RESISTOR0805-RES  [0805]
R36  150  RESISTOR0805-RES  [0805]
R37  150  RESISTOR0805-RES  [0805]
R38  150  RESISTOR0805-RES  [0805]
R39  150  RESISTOR0805-RES  [0805]
R40  150  RESISTOR0805-RES  [0805]
X2  HEBW 21  733980-62  [733980-62]

### Nets
+5V: JP2.1 ; also sheet 2,3,4
GND: Q2.2(S) Q26.2(S) Q27.2(S) Q28.2(S) Q29.2(S) Q30.2(S) Q31.2(S) Q32.2(S) Q33.2(S) Q34.2(S) Q35.2(S) Q36.2(S) Q37.2(S) Q38.2(S) Q39.2(S) Q40.2(S) Q41.2(S) Q42.2(S) Q43.2(S) Q44.2(S) Q45.2(S) Q46.2(S) Q47.2(S) Q48.2(S) Q49.2(S) Q50.2(S) Q51.2(S) Q52.2(S) Q53.2(S) Q54.2(S) Q55.2(S) Q56.2(S) Q57.2(S) Q58.2(S) Q59.2(S) Q60.2(S) Q61.2(S) Q62.2(S) Q63.2(S) Q64.2(S) X2.1 ; also sheet 2,3,4
N$5: LED1.A LED2.A LED3.A LED4.A LED5.A LED6.A LED7.A LED8.A LED9.A LED10.A LED11.A LED12.A LED13.A LED14.A LED15.A LED16.A LED17.A LED18.A LED19.A LED20.A LED21.A LED22.A LED23.A LED24.A LED25.A LED26.A LED27.A LED28.A LED29.A LED30.A LED31.A LED32.A LED33.A LED34.A LED35.A LED36.A LED37.A LED38.A LED39.A LED40.A Q24.3(D)
N$6: LED81.A LED82.A LED83.A LED84.A LED85.A LED86.A LED87.A LED88.A LED89.A LED90.A LED91.A LED92.A LED93.A LED94.A LED95.A LED96.A LED97.A LED98.A LED99.A LED100.A LED101.A LED102.A LED103.A LED104.A LED105.A LED106.A LED107.A LED108.A LED109.A LED110.A LED111.A LED112.A LED113.A LED114.A LED115.A LED116.A LED117.A LED118.A LED119.A LED120.A Q22.3(D)
N$7: Q2.3(D) R1.1
N$8: Q26.3(D) R2.1
N$9: LED2.K(C) LED42.K(C) LED82.K(C) LED122.K(C) LED162.K(C) LED202.K(C) LED242.K(C) LED282.K(C) LED322.K(C) LED362.K(C) LED402.K(C) LED442.K(C) LED482.K(C) LED522.K(C) LED562.K(C) LED602.K(C) LED642.K(C) LED682.K(C) LED722.K(C) LED762.K(C) LED802.K(C) LED842.K(C) LED882.K(C) LED922.K(C) R2.2
N$10: Q27.3(D) R3.1
N$11: Q28.3(D) R4.1
N$12: Q29.3(D) R5.1
N$13: Q30.3(D) R6.1
N$14: Q31.3(D) R7.1
N$15: Q32.3(D) R8.1
N$16: Q33.3(D) R9.1
N$17: Q34.3(D) R10.1
N$18: Q35.3(D) R11.1
N$19: Q36.3(D) R12.1
N$20: Q37.3(D) R13.1
N$21: Q38.3(D) R14.1
N$22: Q39.3(D) R15.1
N$23: Q40.3(D) R16.1
N$24: Q41.3(D) R17.1
N$25: Q42.3(D) R18.1
N$26: Q43.3(D) R19.1
N$27: Q44.3(D) R20.1
N$28: Q45.3(D) R21.1
N$29: Q46.3(D) R22.1
N$30: Q47.3(D) R23.1
N$31: Q48.3(D) R24.1
N$32: Q49.3(D) R25.1
N$33: Q50.3(D) R26.1
N$34: Q51.3(D) R27.1
N$35: Q52.3(D) R28.1
N$36: Q53.3(D) R29.1
N$37: Q54.3(D) R30.1
N$38: Q55.3(D) R31.1
N$39: Q56.3(D) R32.1
N$42: Q57.3(D) R33.1
N$43: Q58.3(D) R34.1
N$44: Q59.3(D) R35.1
N$45: Q60.3(D) R36.1
N$46: LED41.A LED42.A LED43.A LED44.A LED45.A LED46.A LED47.A LED48.A LED49.A LED50.A LED51.A LED52.A LED53.A LED54.A LED55.A LED56.A LED57.A LED58.A LED59.A LED60.A LED61.A LED62.A LED63.A LED64.A LED65.A LED66.A LED67.A LED68.A LED69.A LED70.A LED71.A LED72.A LED73.A LED74.A LED75.A LED76.A LED77.A LED78.A LED79.A LED80.A Q23.3(D)
N$47: Q61.3(D) R37.1
N$48: Q62.3(D) R38.1
N$49: Q63.3(D) R39.1
N$50: Q64.3(D) R40.1
N$64: JP2.2 Q1.2(S) Q3.2(S) Q4.2(S) Q5.2(S) Q6.2(S) Q7.2(S) Q8.2(S) Q9.2(S) Q10.2(S) Q11.2(S) Q12.2(S) Q13.2(S) Q14.2(S) Q15.2(S) Q16.2(S) Q17.2(S) Q18.2(S) Q19.2(S) Q20.2(S) Q21.2(S) Q22.2(S) Q23.2(S) Q24.2(S) Q65.2(S) X2.2
N$88: LED121.A LED122.A LED123.A LED124.A LED125.A LED126.A LED127.A LED128.A LED129.A LED130.A LED131.A LED132.A LED133.A LED134.A LED135.A LED136.A LED137.A LED138.A LED139.A LED140.A LED141.A LED142.A LED143.A LED144.A LED145.A LED146.A LED147.A LED148.A LED149.A LED150.A LED151.A LED152.A LED153.A LED154.A LED155.A LED156.A LED157.A LED158.A LED159.A LED160.A Q21.3(D)
N$129: LED161.A LED162.A LED163.A LED164.A LED165.A LED166.A LED167.A LED168.A LED169.A LED170.A LED171.A LED172.A LED173.A LED174.A LED175.A LED176.A LED177.A LED178.A LED179.A LED180.A LED181.A LED182.A LED183.A LED184.A LED185.A LED186.A LED187.A LED188.A LED189.A LED190.A LED191.A LED192.A LED193.A LED194.A LED195.A LED196.A LED197.A LED198.A LED199.A LED200.A Q20.3(D)
N$170: LED201.A LED202.A LED203.A LED204.A LED205.A LED206.A LED207.A LED208.A LED209.A LED210.A LED211.A LED212.A LED213.A LED214.A LED215.A LED216.A LED217.A LED218.A LED219.A LED220.A LED221.A LED222.A LED223.A LED224.A LED225.A LED226.A LED227.A LED228.A LED229.A LED230.A LED231.A LED232.A LED233.A LED234.A LED235.A LED236.A LED237.A LED238.A LED239.A LED240.A Q19.3(D)
N$211: LED241.A LED242.A LED243.A LED244.A LED245.A LED246.A LED247.A LED248.A LED249.A LED250.A LED251.A LED252.A LED253.A LED254.A LED255.A LED256.A LED257.A LED258.A LED259.A LED260.A LED261.A LED262.A LED263.A LED264.A LED265.A LED266.A LED267.A LED268.A LED269.A LED270.A LED271.A LED272.A LED273.A LED274.A LED275.A LED276.A LED277.A LED278.A LED279.A LED280.A Q18.3(D)
N$252: LED281.A LED282.A LED283.A LED284.A LED285.A LED286.A LED287.A LED288.A LED289.A LED290.A LED291.A LED292.A LED293.A LED294.A LED295.A LED296.A LED297.A LED298.A LED299.A LED300.A LED301.A LED302.A LED303.A LED304.A LED305.A LED306.A LED307.A LED308.A LED309.A LED310.A LED311.A LED312.A LED313.A LED314.A LED315.A LED316.A LED317.A LED318.A LED319.A LED320.A Q17.3(D)
N$293: LED321.A LED322.A LED323.A LED324.A LED325.A LED326.A LED327.A LED328.A LED329.A LED330.A LED331.A LED332.A LED333.A LED334.A LED335.A LED336.A LED337.A LED338.A LED339.A LED340.A LED341.A LED342.A LED343.A LED344.A LED345.A LED346.A LED347.A LED348.A LED349.A LED350.A LED351.A LED352.A LED353.A LED354.A LED355.A LED356.A LED357.A LED358.A LED359.A LED360.A Q16.3(D)
N$334: LED361.A LED362.A LED363.A LED364.A LED365.A LED366.A LED367.A LED368.A LED369.A LED370.A LED371.A LED372.A LED373.A LED374.A LED375.A LED376.A LED377.A LED378.A LED379.A LED380.A LED381.A LED382.A LED383.A LED384.A LED385.A LED386.A LED387.A LED388.A LED389.A LED390.A LED391.A LED392.A LED393.A LED394.A LED395.A LED396.A LED397.A LED398.A LED399.A LED400.A Q15.3(D)
N$375: LED401.A LED402.A LED403.A LED404.A LED405.A LED406.A LED407.A LED408.A LED409.A LED410.A LED411.A LED412.A LED413.A LED414.A LED415.A LED416.A LED417.A LED418.A LED419.A LED420.A LED421.A LED422.A LED423.A LED424.A LED425.A LED426.A LED427.A LED428.A LED429.A LED430.A LED431.A LED432.A LED433.A LED434.A LED435.A LED436.A LED437.A LED438.A LED439.A LED440.A Q14.3(D)
N$416: LED441.A LED442.A LED443.A LED444.A LED445.A LED446.A LED447.A LED448.A LED449.A LED450.A LED451.A LED452.A LED453.A LED454.A LED455.A LED456.A LED457.A LED458.A LED459.A LED460.A LED461.A LED462.A LED463.A LED464.A LED465.A LED466.A LED467.A LED468.A LED469.A LED470.A LED471.A LED472.A LED473.A LED474.A LED475.A LED476.A LED477.A LED478.A LED479.A LED480.A Q13.3(D)
N$457: LED481.A LED482.A LED483.A LED484.A LED485.A LED486.A LED487.A LED488.A LED489.A LED490.A LED491.A LED492.A LED493.A LED494.A LED495.A LED496.A LED497.A LED498.A LED499.A LED500.A LED501.A LED502.A LED503.A LED504.A LED505.A LED506.A LED507.A LED508.A LED509.A LED510.A LED511.A LED512.A LED513.A LED514.A LED515.A LED516.A LED517.A LED518.A LED519.A LED520.A Q12.3(D)
N$498: LED521.A LED522.A LED523.A LED524.A LED525.A LED526.A LED527.A LED528.A LED529.A LED530.A LED531.A LED532.A LED533.A LED534.A LED535.A LED536.A LED537.A LED538.A LED539.A LED540.A LED541.A LED542.A LED543.A LED544.A LED545.A LED546.A LED547.A LED548.A LED549.A LED550.A LED551.A LED552.A LED553.A LED554.A LED555.A LED556.A LED557.A LED558.A LED559.A LED560.A Q11.3(D)
N$539: LED561.A LED562.A LED563.A LED564.A LED565.A LED566.A LED567.A LED568.A LED569.A LED570.A LED571.A LED572.A LED573.A LED574.A LED575.A LED576.A LED577.A LED578.A LED579.A LED580.A LED581.A LED582.A LED583.A LED584.A LED585.A LED586.A LED587.A LED588.A LED589.A LED590.A LED591.A LED592.A LED593.A LED594.A LED595.A LED596.A LED597.A LED598.A LED599.A LED600.A Q10.3(D)
N$580: LED601.A LED602.A LED603.A LED604.A LED605.A LED606.A LED607.A LED608.A LED609.A LED610.A LED611.A LED612.A LED613.A LED614.A LED615.A LED616.A LED617.A LED618.A LED619.A LED620.A LED621.A LED622.A LED623.A LED624.A LED625.A LED626.A LED627.A LED628.A LED629.A LED630.A LED631.A LED632.A LED633.A LED634.A LED635.A LED636.A LED637.A LED638.A LED639.A LED640.A Q9.3(D)
N$621: LED641.A LED642.A LED643.A LED644.A LED645.A LED646.A LED647.A LED648.A LED649.A LED650.A LED651.A LED652.A LED653.A LED654.A LED655.A LED656.A LED657.A LED658.A LED659.A LED660.A LED661.A LED662.A LED663.A LED664.A LED665.A LED666.A LED667.A LED668.A LED669.A LED670.A LED671.A LED672.A LED673.A LED674.A LED675.A LED676.A LED677.A LED678.A LED679.A LED680.A Q8.3(D)
N$702: LED681.A LED682.A LED683.A LED684.A LED685.A LED686.A LED687.A LED688.A LED689.A LED690.A LED691.A LED692.A LED693.A LED694.A LED695.A LED696.A LED697.A LED698.A LED699.A LED700.A LED701.A LED702.A LED703.A LED704.A LED705.A LED706.A LED707.A LED708.A LED709.A LED710.A LED711.A LED712.A LED713.A LED714.A LED715.A LED716.A LED717.A LED718.A LED719.A LED720.A Q7.3(D)
N$743: LED721.A LED722.A LED723.A LED724.A LED725.A LED726.A LED727.A LED728.A LED729.A LED730.A LED731.A LED732.A LED733.A LED734.A LED735.A LED736.A LED737.A LED738.A LED739.A LED740.A LED741.A LED742.A LED743.A LED744.A LED745.A LED746.A LED747.A LED748.A LED749.A LED750.A LED751.A LED752.A LED753.A LED754.A LED755.A LED756.A LED757.A LED758.A LED759.A LED760.A Q6.3(D)
N$784: LED761.A LED762.A LED763.A LED764.A LED765.A LED766.A LED767.A LED768.A LED769.A LED770.A LED771.A LED772.A LED773.A LED774.A LED775.A LED776.A LED777.A LED778.A LED779.A LED780.A LED781.A LED782.A LED783.A LED784.A LED785.A LED786.A LED787.A LED788.A LED789.A LED790.A LED791.A LED792.A LED793.A LED794.A LED795.A LED796.A LED797.A LED798.A LED799.A LED800.A Q5.3(D)
N$825: LED801.A LED802.A LED803.A LED804.A LED805.A LED806.A LED807.A LED808.A LED809.A LED810.A LED811.A LED812.A LED813.A LED814.A LED815.A LED816.A LED817.A LED818.A LED819.A LED820.A LED821.A LED822.A LED823.A LED824.A LED825.A LED826.A LED827.A LED828.A LED829.A LED830.A LED831.A LED832.A LED833.A LED834.A LED835.A LED836.A LED837.A LED838.A LED839.A LED840.A Q4.3(D)
N$866: LED841.A LED842.A LED843.A LED844.A LED845.A LED846.A LED847.A LED848.A LED849.A LED850.A LED851.A LED852.A LED853.A LED854.A LED855.A LED856.A LED857.A LED858.A LED859.A LED860.A LED861.A LED862.A LED863.A LED864.A LED865.A LED866.A LED867.A LED868.A LED869.A LED870.A LED871.A LED872.A LED873.A LED874.A LED875.A LED876.A LED877.A LED878.A LED879.A LED880.A Q3.3(D)
N$907: LED881.A LED882.A LED883.A LED884.A LED885.A LED886.A LED887.A LED888.A LED889.A LED890.A LED891.A LED892.A LED893.A LED894.A LED895.A LED896.A LED897.A LED898.A LED899.A LED900.A LED901.A LED902.A LED903.A LED904.A LED905.A LED906.A LED907.A LED908.A LED909.A LED910.A LED911.A LED912.A LED913.A LED914.A LED915.A LED916.A LED917.A LED918.A LED919.A LED920.A Q1.3(D)
N$948: LED921.A LED922.A LED923.A LED924.A LED925.A LED926.A LED927.A LED928.A LED929.A LED930.A LED931.A LED932.A LED933.A LED934.A LED935.A LED936.A LED937.A LED938.A LED939.A LED940.A LED941.A LED942.A LED943.A LED944.A LED945.A LED946.A LED947.A LED948.A LED949.A LED950.A LED951.A LED952.A LED953.A LED954.A LED955.A LED956.A LED957.A LED958.A LED959.A LED960.A Q65.3(D)
N$1041: LED4.K(C) LED44.K(C) LED84.K(C) LED124.K(C) LED164.K(C) LED204.K(C) LED244.K(C) LED284.K(C) LED324.K(C) LED364.K(C) LED404.K(C) LED444.K(C) LED484.K(C) LED524.K(C) LED564.K(C) LED604.K(C) LED644.K(C) LED684.K(C) LED724.K(C) LED764.K(C) LED804.K(C) LED844.K(C) LED884.K(C) LED924.K(C) R4.2
N$1042: LED5.K(C) LED45.K(C) LED85.K(C) LED125.K(C) LED165.K(C) LED205.K(C) LED245.K(C) LED285.K(C) LED325.K(C) LED365.K(C) LED405.K(C) LED445.K(C) LED485.K(C) LED525.K(C) LED565.K(C) LED605.K(C) LED645.K(C) LED685.K(C) LED725.K(C) LED765.K(C) LED805.K(C) LED845.K(C) LED885.K(C) LED925.K(C) R5.2
N$1043: LED6.K(C) LED46.K(C) LED86.K(C) LED126.K(C) LED166.K(C) LED206.K(C) LED246.K(C) LED286.K(C) LED326.K(C) LED366.K(C) LED406.K(C) LED446.K(C) LED486.K(C) LED526.K(C) LED566.K(C) LED606.K(C) LED646.K(C) LED686.K(C) LED726.K(C) LED766.K(C) LED806.K(C) LED846.K(C) LED886.K(C) LED926.K(C) R6.2
N$1044: LED7.K(C) LED47.K(C) LED87.K(C) LED127.K(C) LED167.K(C) LED207.K(C) LED247.K(C) LED287.K(C) LED327.K(C) LED367.K(C) LED407.K(C) LED447.K(C) LED487.K(C) LED527.K(C) LED567.K(C) LED607.K(C) LED647.K(C) LED687.K(C) LED727.K(C) LED767.K(C) LED807.K(C) LED847.K(C) LED887.K(C) LED927.K(C) R7.2
N$1045: LED8.K(C) LED48.K(C) LED88.K(C) LED128.K(C) LED168.K(C) LED208.K(C) LED248.K(C) LED288.K(C) LED328.K(C) LED368.K(C) LED408.K(C) LED448.K(C) LED488.K(C) LED528.K(C) LED568.K(C) LED608.K(C) LED648.K(C) LED688.K(C) LED728.K(C) LED768.K(C) LED808.K(C) LED848.K(C) LED888.K(C) LED928.K(C) R8.2
N$1046: LED9.K(C) LED49.K(C) LED89.K(C) LED129.K(C) LED169.K(C) LED209.K(C) LED249.K(C) LED289.K(C) LED329.K(C) LED369.K(C) LED409.K(C) LED449.K(C) LED489.K(C) LED529.K(C) LED569.K(C) LED609.K(C) LED649.K(C) LED689.K(C) LED729.K(C) LED769.K(C) LED809.K(C) LED849.K(C) LED889.K(C) LED929.K(C) R9.2
N$1047: LED10.K(C) LED50.K(C) LED90.K(C) LED130.K(C) LED170.K(C) LED210.K(C) LED250.K(C) LED290.K(C) LED330.K(C) LED370.K(C) LED410.K(C) LED450.K(C) LED490.K(C) LED530.K(C) LED570.K(C) LED610.K(C) LED650.K(C) LED690.K(C) LED730.K(C) LED770.K(C) LED810.K(C) LED850.K(C) LED890.K(C) LED930.K(C) R10.2
N$1048: LED11.K(C) LED51.K(C) LED91.K(C) LED131.K(C) LED171.K(C) LED211.K(C) LED251.K(C) LED291.K(C) LED331.K(C) LED371.K(C) LED411.K(C) LED451.K(C) LED491.K(C) LED531.K(C) LED571.K(C) LED611.K(C) LED651.K(C) LED691.K(C) LED731.K(C) LED771.K(C) LED811.K(C) LED851.K(C) LED891.K(C) LED931.K(C) R11.2
N$1049: LED1.K(C) LED41.K(C) LED81.K(C) LED121.K(C) LED161.K(C) LED201.K(C) LED241.K(C) LED281.K(C) LED321.K(C) LED361.K(C) LED401.K(C) LED441.K(C) LED481.K(C) LED521.K(C) LED561.K(C) LED601.K(C) LED641.K(C) LED681.K(C) LED721.K(C) LED761.K(C) LED801.K(C) LED841.K(C) LED881.K(C) LED921.K(C) R1.2
N$1050: LED12.K(C) LED52.K(C) LED92.K(C) LED132.K(C) LED172.K(C) LED212.K(C) LED252.K(C) LED292.K(C) LED332.K(C) LED372.K(C) LED412.K(C) LED452.K(C) LED492.K(C) LED532.K(C) LED572.K(C) LED612.K(C) LED652.K(C) LED692.K(C) LED732.K(C) LED772.K(C) LED812.K(C) LED852.K(C) LED892.K(C) LED932.K(C) R12.2
N$1051: LED13.K(C) LED53.K(C) LED93.K(C) LED133.K(C) LED173.K(C) LED213.K(C) LED253.K(C) LED293.K(C) LED333.K(C) LED373.K(C) LED413.K(C) LED453.K(C) LED493.K(C) LED533.K(C) LED573.K(C) LED613.K(C) LED653.K(C) LED693.K(C) LED733.K(C) LED773.K(C) LED813.K(C) LED853.K(C) LED893.K(C) LED933.K(C) R13.2
N$1052: LED14.K(C) LED54.K(C) LED94.K(C) LED134.K(C) LED174.K(C) LED214.K(C) LED254.K(C) LED294.K(C) LED334.K(C) LED374.K(C) LED414.K(C) LED454.K(C) LED494.K(C) LED534.K(C) LED574.K(C) LED614.K(C) LED654.K(C) LED694.K(C) LED734.K(C) LED774.K(C) LED814.K(C) LED854.K(C) LED894.K(C) LED934.K(C) R14.2
N$1053: LED15.K(C) LED55.K(C) LED95.K(C) LED135.K(C) LED175.K(C) LED215.K(C) LED255.K(C) LED295.K(C) LED335.K(C) LED375.K(C) LED415.K(C) LED455.K(C) LED495.K(C) LED535.K(C) LED575.K(C) LED615.K(C) LED655.K(C) LED695.K(C) LED735.K(C) LED775.K(C) LED815.K(C) LED855.K(C) LED895.K(C) LED935.K(C) R15.2
N$1054: LED16.K(C) LED56.K(C) LED96.K(C) LED136.K(C) LED176.K(C) LED216.K(C) LED256.K(C) LED296.K(C) LED336.K(C) LED376.K(C) LED416.K(C) LED456.K(C) LED496.K(C) LED536.K(C) LED576.K(C) LED616.K(C) LED656.K(C) LED696.K(C) LED736.K(C) LED776.K(C) LED816.K(C) LED856.K(C) LED896.K(C) LED936.K(C) R16.2
N$1055: LED17.K(C) LED57.K(C) LED97.K(C) LED137.K(C) LED177.K(C) LED217.K(C) LED257.K(C) LED297.K(C) LED337.K(C) LED377.K(C) LED417.K(C) LED457.K(C) LED497.K(C) LED537.K(C) LED577.K(C) LED617.K(C) LED657.K(C) LED697.K(C) LED737.K(C) LED777.K(C) LED817.K(C) LED857.K(C) LED897.K(C) LED937.K(C) R17.2
N$1056: LED18.K(C) LED58.K(C) LED98.K(C) LED138.K(C) LED178.K(C) LED218.K(C) LED258.K(C) LED298.K(C) LED338.K(C) LED378.K(C) LED418.K(C) LED458.K(C) LED498.K(C) LED538.K(C) LED578.K(C) LED618.K(C) LED658.K(C) LED698.K(C) LED738.K(C) LED778.K(C) LED818.K(C) LED858.K(C) LED898.K(C) LED938.K(C) R18.2
N$1057: LED19.K(C) LED59.K(C) LED99.K(C) LED139.K(C) LED179.K(C) LED219.K(C) LED259.K(C) LED299.K(C) LED339.K(C) LED379.K(C) LED419.K(C) LED459.K(C) LED499.K(C) LED539.K(C) LED579.K(C) LED619.K(C) LED659.K(C) LED699.K(C) LED739.K(C) LED779.K(C) LED819.K(C) LED859.K(C) LED899.K(C) LED939.K(C) R19.2
N$1058: LED20.K(C) LED60.K(C) LED100.K(C) LED140.K(C) LED180.K(C) LED220.K(C) LED260.K(C) LED300.K(C) LED340.K(C) LED380.K(C) LED420.K(C) LED460.K(C) LED500.K(C) LED540.K(C) LED580.K(C) LED620.K(C) LED660.K(C) LED700.K(C) LED740.K(C) LED780.K(C) LED820.K(C) LED860.K(C) LED900.K(C) LED940.K(C) R20.2
N$1059: LED21.K(C) LED61.K(C) LED101.K(C) LED141.K(C) LED181.K(C) LED221.K(C) LED261.K(C) LED301.K(C) LED341.K(C) LED381.K(C) LED421.K(C) LED461.K(C) LED501.K(C) LED541.K(C) LED581.K(C) LED621.K(C) LED661.K(C) LED701.K(C) LED741.K(C) LED781.K(C) LED821.K(C) LED861.K(C) LED901.K(C) LED941.K(C) R21.2
N$1060: LED22.K(C) LED62.K(C) LED102.K(C) LED142.K(C) LED182.K(C) LED222.K(C) LED262.K(C) LED302.K(C) LED342.K(C) LED382.K(C) LED422.K(C) LED462.K(C) LED502.K(C) LED542.K(C) LED582.K(C) LED622.K(C) LED662.K(C) LED702.K(C) LED742.K(C) LED782.K(C) LED822.K(C) LED862.K(C) LED902.K(C) LED942.K(C) R22.2
N$1061: LED23.K(C) LED63.K(C) LED103.K(C) LED143.K(C) LED183.K(C) LED223.K(C) LED263.K(C) LED303.K(C) LED343.K(C) LED383.K(C) LED423.K(C) LED463.K(C) LED503.K(C) LED543.K(C) LED583.K(C) LED623.K(C) LED663.K(C) LED703.K(C) LED743.K(C) LED783.K(C) LED823.K(C) LED863.K(C) LED903.K(C) LED943.K(C) R23.2
N$1062: LED24.K(C) LED64.K(C) LED104.K(C) LED144.K(C) LED184.K(C) LED224.K(C) LED264.K(C) LED304.K(C) LED344.K(C) LED384.K(C) LED424.K(C) LED464.K(C) LED504.K(C) LED544.K(C) LED584.K(C) LED624.K(C) LED664.K(C) LED704.K(C) LED744.K(C) LED784.K(C) LED824.K(C) LED864.K(C) LED904.K(C) LED944.K(C) R24.2
N$1063: LED25.K(C) LED65.K(C) LED105.K(C) LED145.K(C) LED185.K(C) LED225.K(C) LED265.K(C) LED305.K(C) LED345.K(C) LED385.K(C) LED425.K(C) LED465.K(C) LED505.K(C) LED545.K(C) LED585.K(C) LED625.K(C) LED665.K(C) LED705.K(C) LED745.K(C) LED785.K(C) LED825.K(C) LED865.K(C) LED905.K(C) LED945.K(C) R25.2
N$1064: LED26.K(C) LED66.K(C) LED106.K(C) LED146.K(C) LED186.K(C) LED226.K(C) LED266.K(C) LED306.K(C) LED346.K(C) LED386.K(C) LED426.K(C) LED466.K(C) LED506.K(C) LED546.K(C) LED586.K(C) LED626.K(C) LED666.K(C) LED706.K(C) LED746.K(C) LED786.K(C) LED826.K(C) LED866.K(C) LED906.K(C) LED946.K(C) R26.2
N$1065: LED27.K(C) LED67.K(C) LED107.K(C) LED147.K(C) LED187.K(C) LED227.K(C) LED267.K(C) LED307.K(C) LED347.K(C) LED387.K(C) LED427.K(C) LED467.K(C) LED507.K(C) LED547.K(C) LED587.K(C) LED627.K(C) LED667.K(C) LED707.K(C) LED747.K(C) LED787.K(C) LED827.K(C) LED867.K(C) LED907.K(C) LED947.K(C) R27.2
N$1066: LED28.K(C) LED68.K(C) LED108.K(C) LED148.K(C) LED188.K(C) LED228.K(C) LED268.K(C) LED308.K(C) LED348.K(C) LED388.K(C) LED428.K(C) LED468.K(C) LED508.K(C) LED548.K(C) LED588.K(C) LED628.K(C) LED668.K(C) LED708.K(C) LED748.K(C) LED788.K(C) LED828.K(C) LED868.K(C) LED908.K(C) LED948.K(C) R28.2
N$1067: LED29.K(C) LED69.K(C) LED109.K(C) LED149.K(C) LED189.K(C) LED229.K(C) LED269.K(C) LED309.K(C) LED349.K(C) LED389.K(C) LED429.K(C) LED469.K(C) LED509.K(C) LED549.K(C) LED589.K(C) LED629.K(C) LED669.K(C) LED709.K(C) LED749.K(C) LED789.K(C) LED829.K(C) LED869.K(C) LED909.K(C) LED949.K(C) R29.2
N$1068: LED30.K(C) LED70.K(C) LED110.K(C) LED150.K(C) LED190.K(C) LED230.K(C) LED270.K(C) LED310.K(C) LED350.K(C) LED390.K(C) LED430.K(C) LED470.K(C) LED510.K(C) LED550.K(C) LED590.K(C) LED630.K(C) LED670.K(C) LED710.K(C) LED750.K(C) LED790.K(C) LED830.K(C) LED870.K(C) LED910.K(C) LED950.K(C) R30.2
N$1069: LED31.K(C) LED71.K(C) LED111.K(C) LED151.K(C) LED191.K(C) LED231.K(C) LED271.K(C) LED311.K(C) LED351.K(C) LED391.K(C) LED431.K(C) LED471.K(C) LED511.K(C) LED551.K(C) LED591.K(C) LED631.K(C) LED671.K(C) LED711.K(C) LED751.K(C) LED791.K(C) LED831.K(C) LED871.K(C) LED911.K(C) LED951.K(C) R31.2
N$1070: LED32.K(C) LED72.K(C) LED112.K(C) LED152.K(C) LED192.K(C) LED232.K(C) LED272.K(C) LED312.K(C) LED352.K(C) LED392.K(C) LED432.K(C) LED472.K(C) LED512.K(C) LED552.K(C) LED592.K(C) LED632.K(C) LED672.K(C) LED712.K(C) LED752.K(C) LED792.K(C) LED832.K(C) LED872.K(C) LED912.K(C) LED952.K(C) R32.2
N$1071: LED33.K(C) LED73.K(C) LED113.K(C) LED153.K(C) LED193.K(C) LED233.K(C) LED273.K(C) LED313.K(C) LED353.K(C) LED393.K(C) LED433.K(C) LED473.K(C) LED513.K(C) LED553.K(C) LED593.K(C) LED633.K(C) LED673.K(C) LED713.K(C) LED753.K(C) LED793.K(C) LED833.K(C) LED873.K(C) LED913.K(C) LED953.K(C) R33.2
N$1072: LED34.K(C) LED74.K(C) LED114.K(C) LED154.K(C) LED194.K(C) LED234.K(C) LED274.K(C) LED314.K(C) LED354.K(C) LED394.K(C) LED434.K(C) LED474.K(C) LED514.K(C) LED554.K(C) LED594.K(C) LED634.K(C) LED674.K(C) LED714.K(C) LED754.K(C) LED794.K(C) LED834.K(C) LED874.K(C) LED914.K(C) LED954.K(C) R34.2
N$1073: LED35.K(C) LED75.K(C) LED115.K(C) LED155.K(C) LED195.K(C) LED235.K(C) LED275.K(C) LED315.K(C) LED355.K(C) LED395.K(C) LED435.K(C) LED475.K(C) LED515.K(C) LED555.K(C) LED595.K(C) LED635.K(C) LED675.K(C) LED715.K(C) LED755.K(C) LED795.K(C) LED835.K(C) LED875.K(C) LED915.K(C) LED955.K(C) R35.2
N$1074: LED36.K(C) LED76.K(C) LED116.K(C) LED156.K(C) LED196.K(C) LED236.K(C) LED276.K(C) LED316.K(C) LED356.K(C) LED396.K(C) LED436.K(C) LED476.K(C) LED516.K(C) LED556.K(C) LED596.K(C) LED636.K(C) LED676.K(C) LED716.K(C) LED756.K(C) LED796.K(C) LED836.K(C) LED876.K(C) LED916.K(C) LED956.K(C) R36.2
N$1075: LED37.K(C) LED77.K(C) LED117.K(C) LED157.K(C) LED197.K(C) LED237.K(C) LED277.K(C) LED317.K(C) LED357.K(C) LED397.K(C) LED437.K(C) LED477.K(C) LED517.K(C) LED557.K(C) LED597.K(C) LED637.K(C) LED677.K(C) LED717.K(C) LED757.K(C) LED797.K(C) LED837.K(C) LED877.K(C) LED917.K(C) LED957.K(C) R37.2
N$1076: LED38.K(C) LED78.K(C) LED118.K(C) LED158.K(C) LED198.K(C) LED238.K(C) LED278.K(C) LED318.K(C) LED358.K(C) LED398.K(C) LED438.K(C) LED478.K(C) LED518.K(C) LED558.K(C) LED598.K(C) LED638.K(C) LED678.K(C) LED718.K(C) LED758.K(C) LED798.K(C) LED838.K(C) LED878.K(C) LED918.K(C) LED958.K(C) R38.2
N$1077: LED39.K(C) LED79.K(C) LED119.K(C) LED159.K(C) LED199.K(C) LED239.K(C) LED279.K(C) LED319.K(C) LED359.K(C) LED399.K(C) LED439.K(C) LED479.K(C) LED519.K(C) LED559.K(C) LED599.K(C) LED639.K(C) LED679.K(C) LED719.K(C) LED759.K(C) LED799.K(C) LED839.K(C) LED879.K(C) LED919.K(C) LED959.K(C) R39.2
N$1078: LED40.K(C) LED80.K(C) LED120.K(C) LED160.K(C) LED200.K(C) LED240.K(C) LED280.K(C) LED320.K(C) LED360.K(C) LED400.K(C) LED440.K(C) LED480.K(C) LED520.K(C) LED560.K(C) LED600.K(C) LED640.K(C) LED680.K(C) LED720.K(C) LED760.K(C) LED800.K(C) LED840.K(C) LED880.K(C) LED920.K(C) LED960.K(C) R40.2
N$1079: LED3.K(C) LED43.K(C) LED83.K(C) LED123.K(C) LED163.K(C) LED203.K(C) LED243.K(C) LED283.K(C) LED323.K(C) LED363.K(C) LED403.K(C) LED443.K(C) LED483.K(C) LED523.K(C) LED563.K(C) LED603.K(C) LED643.K(C) LED683.K(C) LED723.K(C) LED763.K(C) LED803.K(C) LED843.K(C) LED883.K(C) LED923.K(C) R3.2
X1: Q2.1(G) ; also sheet 2
X2: Q26.1(G) ; also sheet 2
X3: Q27.1(G) ; also sheet 2
X4: Q28.1(G) ; also sheet 2